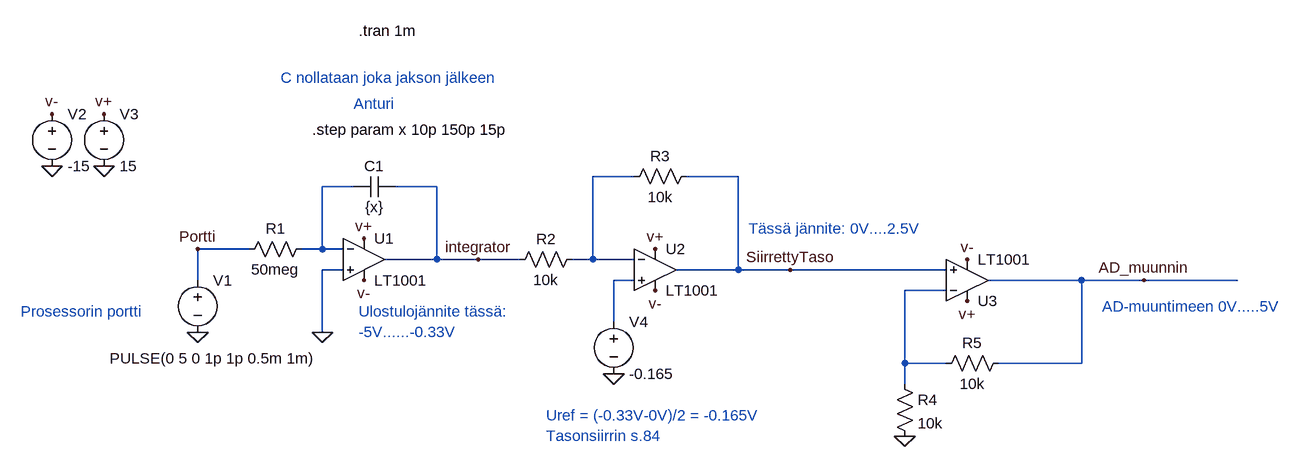
[diagram p0: schematic HT_teht4_anturi_c2.asc]
HT_teht4_anturi_c2.asc, the LTspice schematic file:
Version 4
SHEET 1 1812 680
WIRE 768 16 704 16
WIRE 928 16 848 16
WIRE 336 32 288 32
WIRE 464 32 400 32
WIRE 176 128 96 128
WIRE 288 128 288 32
WIRE 288 128 256 128
WIRE 320 128 288 128
WIRE 464 144 464 32
WIRE 464 144 384 144
WIRE 528 144 464 144
WIRE 592 144 528 144
WIRE 704 144 704 16
WIRE 704 144 672 144
WIRE 768 144 704 144
WIRE 320 160 288 160
WIRE 928 160 928 16
WIRE 928 160 832 160
WIRE 1008 160 928 160
WIRE 1248 160 1008 160
WIRE 96 176 96 128
WIRE 768 176 736 176
WIRE 1456 176 1312 176
WIRE 1552 176 1456 176
WIRE 1696 176 1552 176
WIRE 1248 192 1184 192
WIRE 736 240 736 176
WIRE 288 256 288 160
WIRE 1184 304 1184 192
WIRE 1248 304 1184 304
WIRE 1456 304 1456 176
WIRE 1456 304 1328 304
WIRE 1184 336 1184 304
FLAG -128 0 0
FLAG -48 0 0
FLAG 96 256 0
FLAG 288 256 0
FLAG 352 112 v+
FLAG -48 -80 v+
FLAG 352 176 v-
FLAG -128 -80 v-
FLAG 528 144 integrator
FLAG 736 320 0
FLAG 800 192 v-
FLAG 800 128 v+
FLAG 1008 160 SiirrettyTaso
FLAG 1280 208 v+
FLAG 1280 144 v-
FLAG 1184 416 0
FLAG 1552 176 AD_muunnin
FLAG 96 128 Portti
SYMBOL voltage 96 160 R0
WINDOW 3 -135 136 Left 2
WINDOW 123 0 0 Left 2
WINDOW 39 0 0 Left 2
SYMATTR Value PULSE(0 5 0 1p 1p 0.5m 1m)
SYMATTR InstName V1
SYMBOL voltage -128 -96 R0
WINDOW 123 0 0 Left 2
WINDOW 39 0 0 Left 2
SYMATTR InstName V2
SYMATTR Value -15
SYMBOL voltage -48 -96 R0
WINDOW 123 0 0 Left 2
WINDOW 39 0 0 Left 2
SYMATTR InstName V3
SYMATTR Value 15
SYMBOL Opamps\\LT1001 352 80 R0
SYMATTR InstName U1
SYMBOL cap 400 16 R90
WINDOW 0 0 32 VBottom 2
WINDOW 3 32 32 VTop 2
SYMATTR InstName C1
SYMATTR Value {x}
SYMBOL res 272 112 R90
WINDOW 0 0 56 VBottom 2
WINDOW 3 32 56 VTop 2
SYMATTR InstName R1
SYMATTR Value 50meg
SYMBOL Opamps\\LT1001 800 96 R0
SYMATTR InstName U2
SYMBOL res 688 128 R90
WINDOW 0 0 56 VBottom 2
WINDOW 3 32 56 VTop 2
SYMATTR InstName R2
SYMATTR Value 10k
SYMBOL res 864 0 R90
WINDOW 0 0 56 VBottom 2
WINDOW 3 32 56 VTop 2
SYMATTR InstName R3
SYMATTR Value 10k
SYMBOL voltage 736 224 R0
WINDOW 123 0 0 Left 2
WINDOW 39 0 0 Left 2
SYMATTR InstName V4
SYMATTR Value -0.165
SYMBOL Opamps\\LT1001 1280 240 M180
SYMATTR InstName U3
SYMBOL res 1168 320 R0
SYMATTR InstName R4
SYMATTR Value 10k
SYMBOL res 1344 288 R90
WINDOW 0 0 56 VBottom 2
WINDOW 3 32 56 VTop 2
SYMATTR InstName R5
SYMATTR Value 10k
TEXT -176 224 Left 2 ;Prosessorin portti
TEXT 272 -56 Left 2 !.step param x 10p 150p 15p
TEXT 336 -96 Left 2 ;Anturi
TEXT 224 -136 Left 2 ;C nollataan joka jakson jälkeen
TEXT 344 -208 Left 2 !.tran 1m
TEXT 632 384 Left 2 ;Uref = (-0.33V-0V)/2 = -0.165V\nTasonsiirrin s.84
TEXT 344 224 Left 2 ;Ulostulojännite tässä:\n-5V......-0.33V
TEXT 1488 216 Left 2 ;AD-muuntimeen 0V.....5V
TEXT 944 96 Left 2 ;Tässä jännite: 0V....2.5V

The netlist it stands for:
* HT_teht4_anturi_c2.asc
V1 Portti 0 PULSE(0 5 0 1p 1p 0.5m 1m)
V2 v- 0 -15
V3 v+ 0 15
XU1 0 N002 v+ v- integrator LT1001  ; pins In+ In- V+ V- OUT
C1 integrator N002 {x}
R1 N002 Portti 50meg
XU2 N003 N001 v+ v- SiirrettyTaso LT1001  ; pins In+ In- V+ V- OUT
R2 N001 integrator 10k
R3 SiirrettyTaso N001 10k
V4 N003 0 -0.165
XU3 SiirrettyTaso N004 v+ v- AD_muunnin LT1001  ; pins In+ In- V+ V- OUT
R4 N004 0 10k
R5 AD_muunnin N004 10k
* Prosessorin portti
.step param x 10p 150p 15p
* Anturi
* C nollataan joka jakson jälkeen
.tran 1m
* Uref = (-0.33V-0V)/2 = -0.165V
* Tasonsiirrin s.84
* Ulostulojännite tässä:
* -5V......-0.33V
* AD-muuntimeen 0V.....5V
* Tässä jännite: 0V....2.5V
.lib LTC.lib
.backanno
.end